# EAGLE board registers2a (EAGLE 7.5.0), part 1 of 2
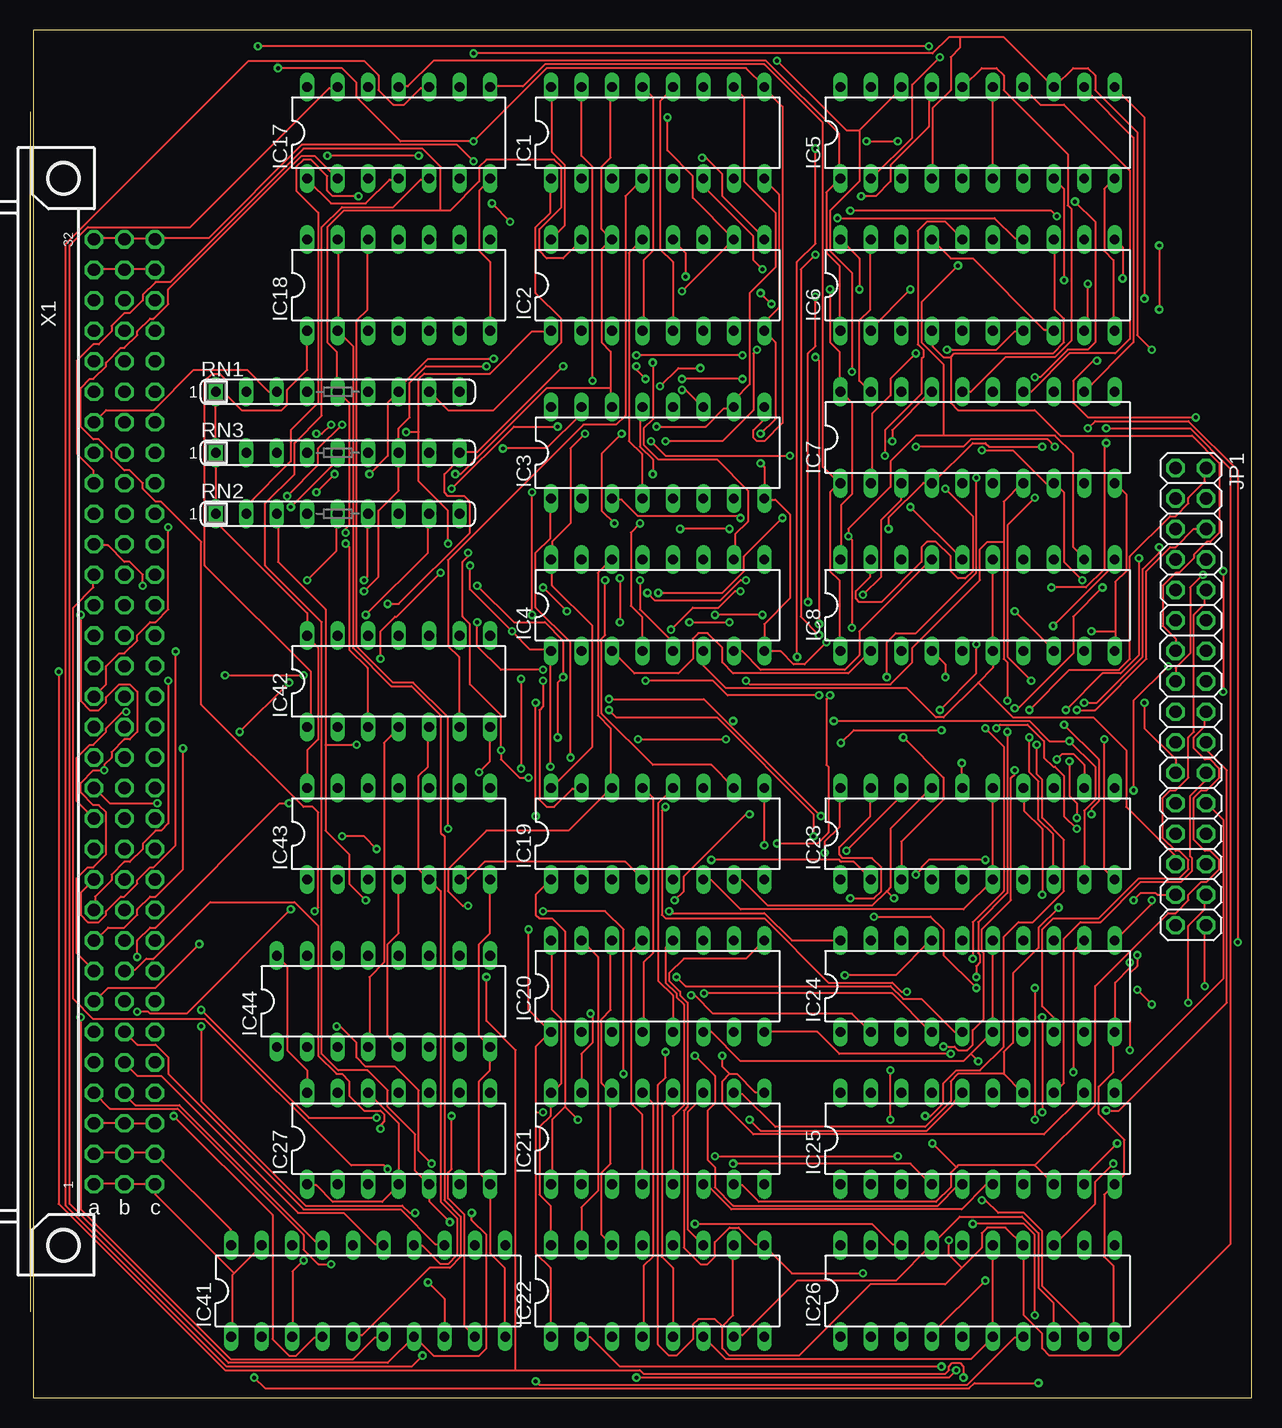
[diagram p3: board, top side]
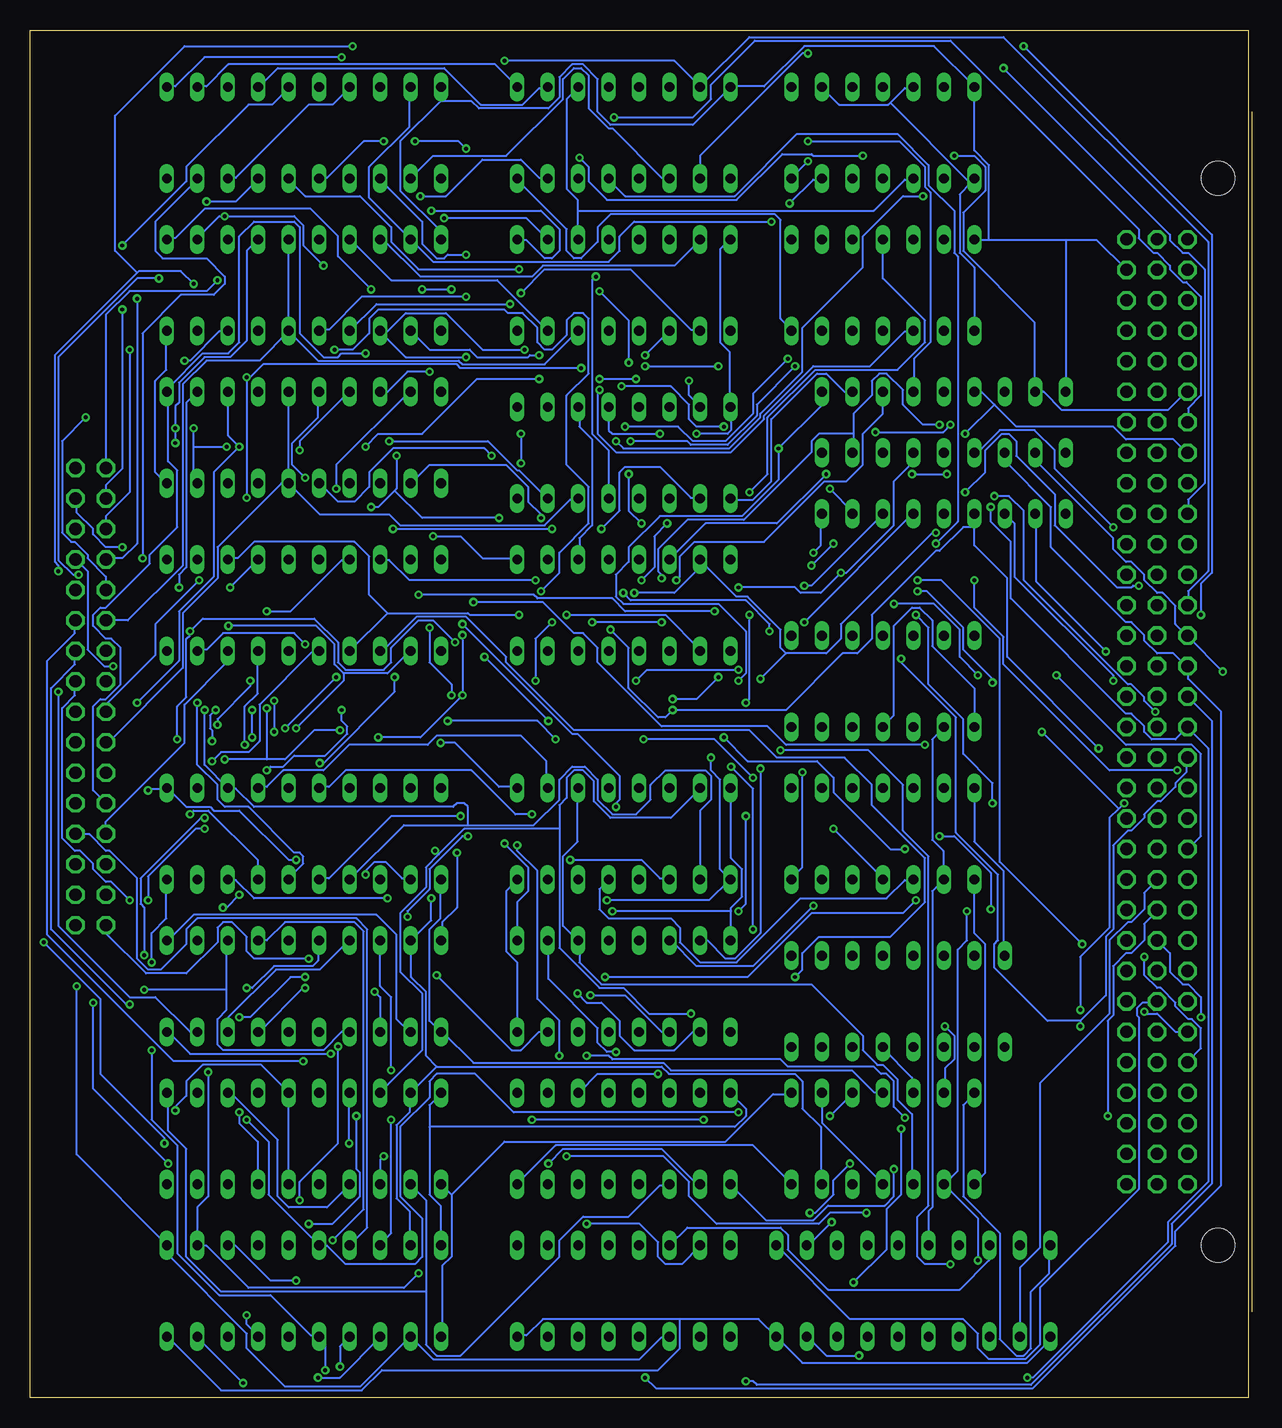
[diagram p4: board, bottom side, seen from below]

Size 101.58 x 113.97 mm. Coordinates in mm from the lower left corner, seen from the top.
Outline: 0,0 101.58,0 101.58,113.97 0,113.97 0,0
Copper layers (1*16): Top 0.0356mm / dielectric 1.5011mm / Bottom 0.0356mm
Design rules "LaenPCBOrder *": minimum track width 6mil, minimum drill 13mil, track to track 6mil, track to pad 6mil, pad to pad 6mil, via to via 6mil, smd to smd 6mil, copper to edge 15mil, drill to drill 6mil, minimum pad ring 7mil, minimum via ring 7mil, stop-mask expansion 3mil, vias tented up to drill 0mil, thermal gap 10mil

## Footprints (pad centres in the part's own frame; a part is rotated, then mirrored left to right if it is on the bottom)
DIL16 = drill 0.813 long: 1 -8.89,-3.81; 2 -6.35,-3.81; 3 -3.81,-3.81; 4 -1.27,-3.81; 5 1.27,-3.81; 6 3.81,-3.81; 7 6.35,-3.81; 8 8.89,-3.81; 9 8.89,3.81; 10 6.35,3.81; 11 3.81,3.81; 12 1.27,3.81; 13 -1.27,3.81; 14 -3.81,3.81; 15 -6.35,3.81; 16 -8.89,3.81
DIL20 = drill 0.813 long: 1 -11.43,-3.81; 2 -8.89,-3.81; 3 -6.35,-3.81; 4 -3.81,-3.81; 5 -1.27,-3.81; 6 1.27,-3.81; 7 3.81,-3.81; 8 6.35,-3.81; 9 8.89,-3.81; 10 11.43,-3.81; 11 11.43,3.81; 12 8.89,3.81; 13 6.35,3.81; 14 3.81,3.81; 15 1.27,3.81; 16 -1.27,3.81; 17 -3.81,3.81; 18 -6.35,3.81; 19 -8.89,3.81; 20 -11.43,3.81
DIL14 = drill 0.813 long: 1 -7.62,-3.81; 2 -5.08,-3.81; 3 -2.54,-3.81; 4 0,-3.81; 5 2.54,-3.81; 6 5.08,-3.81; 7 7.62,-3.81; 8 7.62,3.81; 9 5.08,3.81; 10 2.54,3.81; 11 0,3.81; 12 -2.54,3.81; 13 -5.08,3.81; 14 -7.62,3.81
2X16 = drill 1.016 octagon: 1 -19.05,-1.27; 2 -19.05,1.27; 3 -16.51,-1.27; 4 -16.51,1.27; 5 -13.97,-1.27; 6 -13.97,1.27; 7 -11.43,-1.27; 8 -11.43,1.27; 9 -8.89,-1.27; 10 -8.89,1.27; 11 -6.35,-1.27; 12 -6.35,1.27; 13 -3.81,-1.27; 14 -3.81,1.27; 15 -1.27,-1.27; 16 -1.27,1.27; 17 1.27,-1.27; 18 1.27,1.27; 19 3.81,-1.27; 20 3.81,1.27; 21 6.35,-1.27; 22 6.35,1.27; 23 8.89,-1.27; 24 8.89,1.27; 25 11.43,-1.27; 26 11.43,1.27; 27 13.97,-1.27; 28 13.97,1.27; 29 16.51,-1.27; 30 16.51,1.27; 31 19.05,-1.27; 32 19.05,1.27
SIL9 = drill 0.813 long: 1 -10.16,0; 2 -7.62,0; 3 -5.08,0; 4 -2.54,0; 5 0,0; 6 2.54,0; 7 5.08,0; 8 7.62,0; 9 10.16,0
FABC96R = drill 1.016 octagon: A1 -2.54,39.37; A2 -2.54,36.83; A3 -2.54,34.29; A4 -2.54,31.75; A5 -2.54,29.21; A6 -2.54,26.67; A7 -2.54,24.13; A8 -2.54,21.59; A9 -2.54,19.05; A10 -2.54,16.51; A11 -2.54,13.97; A12 -2.54,11.43; A13 -2.54,8.89; A14 -2.54,6.35; A15 -2.54,3.81; A16 -2.54,1.27; A17 -2.54,-1.27; A18 -2.54,-3.81; A19 -2.54,-6.35; A20 -2.54,-8.89; A21 -2.54,-11.43; A22 -2.54,-13.97; A23 -2.54,-16.51; A24 -2.54,-19.05; A25 -2.54,-21.59; A26 -2.54,-24.13; A27 -2.54,-26.67; A28 -2.54,-29.21; A29 -2.54,-31.75; A30 -2.54,-34.29; A31 -2.54,-36.83; A32 -2.54,-39.37; B1 -5.08,39.37; B2 -5.08,36.83; B3 -5.08,34.29; B4 -5.08,31.75; B5 -5.08,29.21; B6 -5.08,26.67; B7 -5.08,24.13; B8 -5.08,21.59; B9 -5.08,19.05; B10 -5.08,16.51; B11 -5.08,13.97; B12 -5.08,11.43; B13 -5.08,8.89; B14 -5.08,6.35; B15 -5.08,3.81; B16 -5.08,1.27; B17 -5.08,-1.27; B18 -5.08,-3.81; B19 -5.08,-6.35; B20 -5.08,-8.89; B21 -5.08,-11.43; B22 -5.08,-13.97; B23 -5.08,-16.51; B24 -5.08,-19.05; B25 -5.08,-21.59; B26 -5.08,-24.13; B27 -5.08,-26.67; B28 -5.08,-29.21; B29 -5.08,-31.75; B30 -5.08,-34.29; B31 -5.08,-36.83; B32 -5.08,-39.37; C1 -7.62,39.37; C2 -7.62,36.83; C3 -7.62,34.29; C4 -7.62,31.75; C5 -7.62,29.21; C6 -7.62,26.67; C7 -7.62,24.13; C8 -7.62,21.59; C9 -7.62,19.05; C10 -7.62,16.51; C11 -7.62,13.97; C12 -7.62,11.43; C13 -7.62,8.89; C14 -7.62,6.35; C15 -7.62,3.81; C16 -7.62,1.27; C17 -7.62,-1.27; C18 -7.62,-3.81; C19 -7.62,-6.35; C20 -7.62,-8.89; C21 -7.62,-11.43; C22 -7.62,-13.97; C23 -7.62,-16.51; C24 -7.62,-19.05; C25 -7.62,-21.59; C26 -7.62,-24.13; C27 -7.62,-26.67; C28 -7.62,-29.21; C29 -7.62,-31.75; C30 -7.62,-34.29; C31 -7.62,-36.83; C32 -7.62,-39.37 | hole 2.794: 0,-44.456; 0,44.456

## Placement (x,y rotation side)
IC1  74LS192N  [DIL16]  52.07,105.41 0 top
IC2  74LS192N  [DIL16]  52.07,92.71 0 top
IC3  74LS192N  [DIL16]  52.07,78.74 0 top
IC4  74LS192N  [DIL16]  52.07,66.04 0 top
IC5  74LS244N  [DIL20]  78.74,105.41 0 top
IC6  74LS244N  [DIL20]  78.74,92.71 0 top
IC7  74LS244N  [DIL20]  78.74,80.01 0 top
IC8  74LS244N  [DIL20]  78.74,66.04 0 top
IC17  7400N  [DIL14]  30.48,105.41 0 top
IC18  7400N  [DIL14]  30.48,92.71 0 top
IC19  74LS192N  [DIL16]  52.07,46.99 0 top
IC20  74LS192N  [DIL16]  52.07,34.29 0 top
IC21  74LS192N  [DIL16]  52.07,21.59 0 top
IC22  74LS192N  [DIL16]  52.07,8.89 0 top
IC23  74LS244N  [DIL20]  78.74,46.99 0 top
IC24  74LS244N  [DIL20]  78.74,34.29 0 top
IC25  74LS244N  [DIL20]  78.74,21.59 0 top
IC26  74LS244N  [DIL20]  78.74,8.89 0 top
IC27  7400N  [DIL14]  30.48,21.59 0 top
IC41  74S244N  [DIL20]  27.94,8.89 0 top
IC42  74LS08N  [DIL14]  30.48,59.69 0 top
IC43  74LS08N  [DIL14]  30.48,46.99 0 top
IC44  74LS139N  [DIL16]  29.21,33.02 0 top
JP1  [2X16]  96.52,58.42 270 top
RN1  [SIL9]  25.4,83.82 0 top
RN2  [SIL9]  25.4,73.66 0 top
RN3  [SIL9]  25.4,78.74 0 top
X1  FABC96R  [FABC96R]  2.54,57.15 180 top

## Tracks (layer width: path | path; a pad name or v marks a point on that pad's centre or on a via)
+12V
  Top 0.152: X1.A3 X1.B3 X1.C3
ADDR0  (via drill 0.33)
  Top 0.152: IC23.9 87.63,48.92 88.54,49.84 88.54,52.58 v86.41,54.71 84.73,54.71 83.06,56.39 v66.75,56.39 | v86.11,57.3 89.15,60.35 90.68,60.35 92.2,61.87 v92.2,69.95 | v36.27,70.41 36.27,70.1 35.81,69.65 35.81,65.08 36.42,64.47 36.42,59.44 39.01,56.84 v39.01,53.95 39.01,53.19 40.54,51.66 v41.3,51.66 | v24.84,11.12 23.77,11.12 22.55,12.34 22.55,13.56 12.04,24.08 6.4,24.08 X1.A4 | v50.44,54.86 v57.76,54.86
  Bottom 0.152: v86.41,54.71 86.41,55.63 86.56,55.78 86.56,56.84 v86.11,57.3 | v92.2,69.95 92.2,88.7 89,91.9 86.26,91.9 85.34,92.81 85.34,93.42 86.87,94.94 90.53,94.94 91.14,95.56 91.14,97.99 87.63,101.5 IC5.9 | v36.27,70.41 35.66,71.02 35.66,73.61 RN2.9 | v39.01,53.95 31.7,53.95 28.8,51.05 28.8,47.24 26.67,45.11 26.67,16 27.58,15.09 27.58,11.73 26.98,11.12 v24.84,11.12 | v66.75,56.39 59.28,56.39 v57.76,54.86 | v50.44,54.86 44.5,54.86 v41.3,51.66
ADDR1  (via drill 0.33)
  Top 0.152: v88.24,48.62 88.24,49.07 88.85,49.68 88.85,53.19 v85.95,56.08 | v83.21,59.74 81.23,61.72 81.23,72.69 v83.52,74.98 | v83.52,85.04 83.97,85.04 86.26,87.33 87.94,87.33 88.54,87.94 88.54,97.99 v86.87,99.67 | v27.74,65.23 32.92,70.41 32.92,73.61 RN2.8 | v21.34,49.53 20.57,49.53 10.21,39.17 9.75,39.17 8.69,38.1 v8.69,36.73 | v55.63,85.8 53.8,85.8 v52.27,84.28 | v43.74,80.92 40.08,80.92 v34.9,75.74
  Bottom 0.152: v88.24,48.62 87.94,48.92 86.72,48.92 82.6,44.81 82.6,43.28 IC23.7 | v85.95,56.08 85.95,56.54 83.21,59.28 v83.21,59.74 | v83.52,74.98 v83.52,85.04 83.21,85.04 82.14,86.11 65.99,86.11 65.68,85.8 v55.63,85.8 | v86.87,99.67 84.43,99.67 82.6,101.5 IC5.7 | v27.74,65.23 26.67,64.16 26.67,59.44 23.77,56.54 23.77,53.65 21.34,51.21 v21.34,49.53 | v8.69,36.73 8.69,35.2 7.62,34.14 7.32,34.14 6.1,32.92 6.1,32.61 5.03,31.55 4.72,31.55 3.96,30.79 3.96,29.11 5.03,28.04 X1.A5 | v52.27,84.28 48.16,84.28 46.63,82.75 46.63,81.53 46.02,80.92 v43.74,80.92 | v34.9,75.74 32.92,73.76 RN2.8
ADDR2  (via drill 0.33)
  Top 0.152: 58.06,56.08 55.93,58.22 v48.01,58.22 | 58.06,56.08 v65.68,48.46 | v37.03,67.67 40.08,64.62 42.67,64.62 44.2,63.09 v44.2,60.05 43.74,59.59 v43.74,55.02 | v69.49,104.7 v72.08,104.7 | v65.23,104.09 65.23,96.16 63.7,94.64 v63.7,61.72 | 58.06,56.08 v58.37,56.39 | v8.69,32.16 9.6,32.16 9.75,32 12.8,32 v21.49,40.69 | v25.76,46.79 27.58,46.79 v28.65,45.72
  Bottom 0.152: v65.68,48.46 71.48,48.46 76.66,43.28 77.42,43.28 IC23.5 | v48.01,58.22 46.02,58.22 v44.2,60.05 | v37.03,67.67 36.42,67.67 30.48,73.61 RN2.7 | v72.08,104.7 73.76,104.7 76.81,101.65 77.42,101.65 IC5.5 | v69.49,104.7 65.84,104.7 v65.23,104.09 | v58.37,56.39 v63.7,61.72 | X1.A6 6.1,30.48 7.62,32 8.53,32 v8.69,32.16 | v21.49,40.69 21.49,43.74 24.54,46.79 v25.76,46.79 | v28.65,45.72 29.87,45.72 34.59,50.44 34.59,51.66 35.97,53.03 41.76,53.03 v43.74,55.02
ADDR3  (via drill 0.33)
  Top 0.152: v27.58,68.12 27.89,68.43 27.89,73.61 RN2.6 | v13.87,37.8 10.21,34.14 6.25,34.14 5.18,33.07 X1.A7 | IC23.3 72.39,46.33 75.89,49.84 75.89,51.66 v72.54,55.02 | v65.53,63.55 64.01,65.08 64.01,94.03 v65.23,95.25 | v37.03,64.62 37.03,62.64 39.01,60.66 v42.52,60.66 | v51.05,59.74 56.69,59.74 57.91,58.52 v65.53,58.52
  Bottom 0.152: v27.58,68.12 25.6,68.12 20.73,63.25 20.73,44.65 v13.87,37.8 | v72.54,55.02 69.04,55.02 v65.53,58.52 v65.53,63.55 | v65.23,95.25 66.75,95.25 67.06,94.94 67.67,94.94 68.89,96.16 68.89,97.99 72.39,101.5 IC5.3 | v37.03,64.62 28.04,73.61 RN2.6 | v42.52,60.66 50.14,60.66 v51.05,59.74
ADDR4  (via drill 0.33)
  Top 0.152: v22.86,68.12 25.3,70.56 25.3,73.61 RN2.5 | X1.A8 5.03,35.66 3.66,37.03 3.66,43.28 4.57,44.2 5.03,44.2 6.1,45.26 6.1,48.77 5.49,49.38 5.03,49.38 3.96,50.44 3.96,51.21 5.03,52.27 v5.94,52.27 5.94,52.73 6.55,53.34 6.55,53.8 7.62,54.86 8.08,54.86 8.69,55.47 8.69,58.83 8.08,59.44 7.16,59.44 6.1,58.37 6.1,57.91 5.49,57.3 4.72,57.3 3.96,58.06 v3.96,65.23 | v99.21,68.89 v99.21,58.83 | v87.94,92.81 87.94,89.31 87.63,89 IC6.9 | v74.68,112.62 v18.75,112.62
  Bottom 0.152: v22.86,68.12 22.86,65.84 20.42,63.4 20.42,61.11 11.58,52.27 v5.94,52.27 | IC24.9 88.24,30.48 91.14,33.38 93.27,33.38 99.21,39.32 v99.21,58.83 | v99.21,68.89 99.21,69.34 99.52,69.65 99.52,86.87 92.66,93.73 | 92.66,93.73 92.51,93.88 89,93.88 v87.94,92.81 | v3.96,65.23 3.96,67.82 3.05,68.73 3.05,96.93 v18.75,112.62 | v74.68,112.62 88.7,112.62 94.49,106.83 94.49,95.56 92.66,93.73
ADDR5  (via drill 0.33)
  Top 0.152: v12.5,54.1 12.5,44.04 10.21,41.76 9.75,41.76 8.69,40.69 8.69,40.23 7.62,39.17 6.25,39.17 5.18,38.1 X1.A9 | v78.64,34.14 75.89,36.88 75.89,39.01 74.83,40.08 v70.1,40.08 | v65.08,46.79 65.08,48.62 57,56.69 48.62,56.69 v48.01,57.3 | v76.2,87.33 80.31,87.33 81.84,88.85 82.45,88.85 IC6.7 | v58.98,67.21 58.52,67.21 57.15,65.84 55.02,65.84 v53.19,64.01
  Bottom 0.152: 22.86,72.54 22.86,71.02 20.12,68.28 20.12,61.72 v12.5,54.1 | 22.86,72.54 RN2.4 22.86,73.61 | v78.64,34.14 78.79,34.14 82.45,30.48 IC24.7 | v70.1,40.08 70.1,40.54 68.28,42.37 68.28,44.04 65.53,46.79 v65.08,46.79 | 22.86,72.54 23.77,72.54 25.76,70.56 26.06,70.56 31.39,65.23 31.39,63.25 32.61,62.03 33.83,62.03 38.56,57.3 v48.01,57.3 48.62,56.69 49.23,56.69 51.66,59.13 51.66,62.48 v53.19,64.01 | v76.2,87.33 74.68,87.33 73.3,88.7 73.3,89.92 72.54,90.68 62.03,90.68 61.72,90.37 60.5,90.37 59.28,89.15 59.28,87.94 58.67,87.33 58.06,87.33 56.84,88.54 56.84,89.76 56.24,90.37 55.47,90.37 55.02,89.92 55.02,85.34 56.84,83.52 56.84,77.72 55.02,75.89 55.02,72.85 57.45,70.41 57.45,68.73 v58.98,67.21
ADDR6  (via drill 0.33)
  Top 0.152: IC24.5 76.81,30.48 74.07,33.22 72.54,33.22 71.48,34.29 54.41,34.29 v53.65,35.05 | v27.74,41.45 26.36,42.82 26.36,45.26 24.38,47.24 24.38,54.41 | 24.38,54.41 24.38,65.68 20.42,69.65 20.42,73.61 RN2.3 | v65.23,91.75 65.23,87.63 64.62,87.02 v64.62,66.29 | 24.38,54.41 v26.98,54.41 | v11.28,59.74 11.28,47.85 10.67,47.24 10.21,47.24 9.14,46.18 9.14,45.72 8.08,44.65 7.62,44.65 6.55,43.59 6.55,43.13 5.18,41.76 5.18,40.69 X1.A10
  Bottom 0.152: v53.65,35.05 41.76,35.05 36.42,40.39 28.8,40.39 v27.74,41.45 | v65.23,91.75 73.91,91.75 76.66,89 77.42,89 IC6.5 | v64.62,66.29 58.83,66.29 56.24,63.7 55.47,63.7 54.25,62.48 54.25,61.27 48.92,55.93 40.08,55.93 38.56,54.41 v26.98,54.41 | v11.28,59.74 11.28,60.2 19.51,68.43 19.51,72.85 RN2.3
ADDR7  (via drill 0.33)
  Top 0.152: v11.89,62.18 11.89,46.02 10.06,44.2 9.75,44.2 8.69,43.13 8.69,42.82 7.62,41.76 7.32,41.76 6.1,40.54 6.1,40.23 5.49,39.62 4.57,39.62 3.96,40.23 3.96,42.06 X1.A11 | v72.85,33.83 72.39,33.83 71.63,34.59 66.29,34.59 60.96,39.93 52.73,39.93 52.43,40.23 52.43,48.92 v52.73,49.23 | v65.53,64.47 65.53,86.41 v65.23,86.72 | v27.13,100.13 24.99,100.13 24.54,100.58 24.54,101.8 23.16,103.17 22.55,103.17 21.95,102.56 21.95,100.58 23.77,98.75 23.77,82.91 21.49,80.62 21.49,78.03 17.83,74.37 17.83,73.76 RN2.2 | v52.73,79.7 57.45,79.7 60.05,82.3 60.05,87.02 v60.35,87.33
  Bottom 0.152: v11.89,62.18 17.68,67.97 17.68,73.61 RN2.2 | IC24.3 72.39,33.38 v72.85,33.83 | v52.73,49.23 52.73,49.53 52.43,49.84 52.43,51.82 55.93,55.32 56.39,55.32 v65.53,64.47 | v65.23,86.72 70.26,86.72 72.08,88.54 | 72.08,88.54 72.39,88.85 IC6.3 72.08,88.54 | v27.13,100.13 28.8,100.13 32.16,96.77 32.16,94.18 37.19,89.15 37.19,85.5 40.69,81.99 40.69,81.69 43.28,79.1 52.12,79.1 v52.73,79.7 | v60.35,87.33 63.86,87.33 66.9,90.37 70.26,90.37 72.08,88.54
ADDR8  (via drill 0.33)
  Top 0.152: v29.57,66.14 30.48,66.14 36.42,72.08 36.42,74.68 35.97,75.13 34.59,75.13 34.29,75.44 34.29,76.96 35.51,78.18 35.51,78.64 RN3.9 35.66,78.79 37.03,78.79 v44.2,85.95 | v16,60.2 v22.55,60.2 | IC25.9 87.63,18.44 v90.37,21.18 | v100.43,37.95 100.43,77.27 96.32,81.38 88.54,81.38 v87.94,80.77 | v50.29,85.95 50.29,85.65 v51.05,84.89 | v59.13,84.89 v54.1,84.89 | v73.61,79.25 77.57,79.25 78.18,79.86 84.58,79.86 v85.19,79.25
  Bottom 0.152: v29.57,66.14 26.21,66.14 24.08,64.01 24.08,61.72 v22.55,60.2 | v16,60.2 10.21,54.41 4.72,54.41 3.96,53.65 3.96,46.79 5.03,45.72 X1.A12 | v90.37,21.18 90.37,21.64 95.71,26.98 95.71,33.22 v100.43,37.95 | 87.94,79.25 87.94,76.5 IC7.9 | 87.94,79.25 v87.94,80.77 | v50.29,85.95 v44.2,85.95 | v54.1,84.89 v51.05,84.89 | v59.13,84.89 64.31,84.89 68.89,80.31 72.54,80.31 v73.61,79.25 | 87.94,79.25 v85.19,79.25
ADDR9  (via drill 0.33)
  Top 0.152: v84.12,31.7 v84.12,23.77 | v78.64,35.05 78.64,35.97 78.94,36.27 78.94,36.88 78.79,37.03 78.79,39.62 81.23,42.06 v81.23,55.47 | v81.23,58.06 81.23,61.27 80.92,61.57 80.92,71.32 | 80.92,71.32 80.92,74.68 82.45,76.2 IC7.7 | v25.76,81.08 23.77,79.1 23.77,77.72 v21.18,75.13 | v7.77,57.15 7.47,57.15 6.1,55.78 6.1,55.47 5.03,54.41 4.72,54.41 3.66,53.34 3.66,49.68 X1.A13 | 80.92,71.32 79.55,71.32 78.94,70.71 78.94,68.12 73.3,62.48 73.3,61.27 71.48,59.44 59.74,59.44 v59.44,59.74 | v54.71,64.62 v58.06,64.62 | v48.92,68.28 v48.92,64.62
  Bottom 0.152: v84.12,23.77 84.12,22.86 82.6,21.34 82.6,17.83 IC25.7 | v84.12,31.7 83.21,31.7 79.86,35.05 v78.64,35.05 | v81.23,58.06 v81.23,55.47 | 32.92,80.31 32.92,81.99 31.39,83.52 31.39,84.73 30.79,85.34 30.18,85.34 28.8,83.97 28.8,82.75 27.13,81.08 v25.76,81.08 | 32.92,80.31 32.92,78.79 RN3.8 | v21.18,75.13 19.96,75.13 18.75,73.91 18.75,68.12 10.06,59.44 9.75,59.44 8.69,58.37 8.69,58.06 v7.77,57.15 | v59.44,59.74 59.44,63.25 v58.06,64.62 | v48.92,64.62 v54.71,64.62 | v48.92,68.28 48.92,68.58 49.23,68.89 49.23,70.71 46.79,73.15 42.06,73.15 36.42,78.79 36.42,79.7 35.81,80.31 32.92,80.31
ADDR10  (via drill 0.33)
  Top 0.152: v55.17,28.5 56.84,26.82 56.84,24.54 56.24,23.93 56.24,19.81 56.84,19.2 56.84,17.53 58.37,16 75.44,16 77.11,17.68 77.42,17.68 IC25.5 | v28.65,23.32 23.01,23.32 v14.02,32.31 | v10.36,49.53 6.4,49.53 5.18,50.75 X1.A14 | v27.58,67.21 28.8,68.43 28.8,73.91 30.48,75.59 RN3.7 30.48,80.77 31.39,81.69 31.39,84.58 32.77,85.95 v37.8,85.95 | v17.22,55.47 v21.34,59.59 | v63.09,78.49 52.73,78.49 v51.51,79.7
  Bottom 0.152: v55.17,28.5 53.34,28.5 53.03,28.19 39.01,28.19 38.41,27.58 31.24,27.58 30.63,26.98 30.18,26.98 29.57,26.36 29.57,24.23 v28.65,23.32 | v14.02,32.31 14.02,36.73 11.58,39.17 11.58,48.31 10.82,49.07 | v10.36,49.53 10.82,49.07 | v27.58,67.21 26.82,67.21 23.77,64.16 23.77,62.33 21.34,59.89 v21.34,59.59 | 10.82,49.07 v17.22,55.47 | v63.09,78.49 63.7,79.1 71.32,79.1 73.3,77.11 73.3,75.89 74.52,74.68 75.89,74.68 77.42,76.2 IC7.5 | v51.51,79.7 46.79,79.7 46.48,79.4 43.43,79.4 41,81.84 41,82.75 v37.8,85.95
ADDR11  (via drill 0.33)
  Top 0.152: v56.84,20.12 v72.08,20.12 | v31.85,15.39 31.39,15.39 30.79,16 22.71,16 14.02,24.69 v14.02,30.94 | v33.98,68.73 30.33,65.08 30.18,65.08 28.96,63.86 v28.96,61.57 | IC7.3 72.39,74.83 70.71,73.15 70.71,68.43 v69.19,66.9 | v42.52,67.51 v44.5,65.53
  Bottom 0.152: IC25.3 72.39,19.81 v72.08,20.12 | v56.84,20.12 48.77,20.12 46.63,17.98 46.63,16.76 44.35,14.48 35.81,14.48 34.9,15.39 v31.85,15.39 | 14.02,31.39 v14.02,30.94 | 14.02,31.39 11.89,33.53 11.89,38.41 11.28,39.01 11.28,46.02 10.06,47.24 9.75,47.24 8.69,48.31 8.69,48.62 7.62,49.68 7.32,49.68 6.1,50.9 6.1,51.21 5.18,52.12 5.18,53.34 X1.A15 | v28.96,61.57 28.96,61.27 24.38,56.69 24.38,47.09 20.88,43.59 20.88,38.1 21.18,37.8 21.18,35.81 16.76,31.39 14.02,31.39 | RN3.6 28.04,78.64 28.04,77.88 29.57,76.35 29.57,72.69 33.53,68.73 v33.98,68.73 35.66,67.06 37.34,67.06 37.8,67.51 v42.52,67.51 | v69.19,66.9 59.59,66.9 59.28,66.6 53.03,66.6 51.97,65.53 v44.5,65.53
ADDR12  (via drill 0.33)
  Top 0.152: v21.49,74.22 25.3,78.03 25.3,78.64 RN3.5 | v83.82,1.22 78.49,1.22 78.03,0.76 19.36,0.76 v18.44,1.68 | v78.64,62.79 78.64,60.35 v75.59,57.3 | v81.84,52.27 81.84,51.97 81.53,51.66 81.53,41.45 79.1,39.01 79.1,37.19 79.25,37.03 79.25,31.55 78.33,30.63 78.33,29.41 77.88,28.96 77.11,28.96 76.81,29.26 v75.89,29.26 | v79.1,16.46 79.4,16.46 80.47,15.39 82.6,15.39 84.12,13.87 84.12,9.3 87.63,5.79 IC26.9
  Bottom 0.152: v21.49,74.22 21.49,73 19.81,71.32 19.81,66.6 10.21,57 9.75,57 8.69,55.93 8.69,55.47 8.08,54.86 6.1,54.86 X1.A16 5.03,55.78 3.35,54.1 3.35,17.98 6.71,14.63 6.71,12.95 17.98,1.68 v18.44,1.68 | v83.82,1.22 87.63,5.03 IC26.9 | v78.64,62.79 79.55,63.7 85.5,63.7 86.87,62.33 87.63,62.33 IC8.9 | v75.59,57.3 75.59,56.39 75.13,55.93 75.13,55.32 76.96,53.49 79.55,53.49 80.47,52.58 81.53,52.58 v81.84,52.27 | v75.89,29.26 75.89,21.18 79.1,17.98 v79.1,16.46
ADDR13  (via drill 0.33)
  Top 0.152: v41.91,1.37 42.22,1.07 77.88,1.07 81.84,5.03 82.45,5.03 IC26.7 | v11.28,72.54 11.28,65.68 10.21,64.62 9.75,64.62 8.69,63.55 8.69,63.09 7.62,62.03 7.16,62.03 6.1,60.96 6.1,59.44 X1.A17 | v83.67,54.41 83.67,51.97 84.12,51.51 84.12,48.31 85.95,46.48 85.95,42.22 83.36,39.62 82.14,39.62 80.92,38.41 80.92,29.26 78.94,27.28 76.96,27.28 75.89,26.21 75.89,24.54 74.83,23.47 v74.37,23.47 | v78.33,14.48 82.6,14.48 83.52,13.56 v83.52,6.86
  Bottom 0.152: v41.91,1.37 41.3,1.37 41,1.07 18.14,1.07 6.4,12.8 6.4,14.48 3.05,17.83 3.05,56.39 X1.A17 | v11.28,72.54 16.15,77.42 16.15,78.94 17.83,80.62 20.73,80.62 22.55,78.79 22.86,78.79 RN3.4 | v83.67,54.41 83.67,57.61 82.6,58.67 82.6,62.18 IC8.7 | v74.37,23.47 74.37,19.05 74.07,18.75 74.07,16.76 76.35,14.48 v78.33,14.48 | v83.52,6.86 83.52,6.1 82.6,5.18 IC26.7
ADDR14  (via drill 0.33)
  Top 0.152: v91.44,28.96 91.44,35.36 92.05,35.97 v92.05,36.88 | v87.02,48.31 87.02,49.53 86.41,50.14 v86.41,53.03 | v50.29,1.68 76.35,1.68 v76.96,2.29
  Bottom 0.152: RN3.3 20.27,78.64 20.27,78.03 16.46,74.22 16.46,70.87 10.21,64.62 9.75,64.62 8.69,63.55 8.69,63.09 7.62,62.03 6.25,62.03 5.18,60.96 X1.A18 5.03,60.96 5.03,59.89 2.29,57.15 2.29,17.68 6.1,13.87 6.1,12.65 17.98,0.76 49.38,0.76 v50.29,1.68 | v91.44,28.96 91.44,23.16 89.31,21.03 89.31,12.04 85.8,8.53 81.53,8.53 78.18,5.18 77.57,5.18 IC26.5 76.96,4.57 v76.96,2.29 | v92.05,36.88 92.05,40.84 92.35,41.15 92.35,43.28 87.33,48.31 v87.02,48.31 | v86.41,53.03 85.65,53.8 83.36,53.8 82.45,54.71 82.45,57.76 78.03,62.18 77.57,62.18 IC8.5
ADDR15  (via drill 0.33)
  Top 0.152: v77.57,1.68 77.57,2.59 77.27,2.9 76.66,2.9 76.35,2.59 76.35,2.29 76.05,1.98 50.9,1.98 50.6,2.29 40.23,2.29 | 40.23,2.29 16,2.29 2.13,16.15 v2.13,60.5 | v37.8,35.05 37.8,31.39 40.23,28.96 40.23,2.29
  Bottom 0.152: v77.57,1.68 75.74,1.68 72.39,5.03 IC26.3 | v2.13,60.5 5.03,63.4 X1.A19 5.18,63.55 6.1,64.47 6.1,65.99 7.16,67.06 7.62,67.06 8.69,68.12 8.69,68.58 9.75,69.65 10.21,69.65 11.28,70.71 11.28,71.63 17.68,78.03 17.68,78.64 RN3.2 | v37.8,35.05 37.19,35.66 37.19,37.03 35.81,38.41 29.87,38.41 26.98,41.3 26.98,44.96 31.39,49.38 31.39,51.05 33.68,53.34 39.32,53.34 41.6,55.63 56.24,55.63 61.87,61.27 61.87,61.72 65.23,65.08 69.34,65.08 72.08,62.33 72.39,62.33 IC8.3
DATA0  (via drill 0.33)
  Top 0.152: IC21.15 45.72,28.65 46.63,29.57 46.63,31.85 v46.48,32 | IC23.18 72.39,50.14 v67.82,45.57 | v68.28,85.5 68.28,93.73 66.45,95.56 66.45,98.91 68.89,101.35 68.89,105.61 | 68.89,105.61 72.39,109.12 IC5.18 | v39.17,79.1 42.82,79.1 45.72,81.99 IC3.15 | IC1.15 45.72,103.48 46.63,102.56 v46.63,84.73 | 68.89,105.61 67.82,105.61 v62.03,111.4 | v42.52,59.74 42.52,57.61 42.22,57.3 42.22,49.84 42.82,49.23 43.43,49.23 44.96,50.75 45.72,50.75 IC19.15
  Bottom 0.152: v46.48,32 49.99,32 52.12,34.14 54.1,34.14 57.45,37.49 57.45,47.4 | 57.45,47.4 57.45,49.38 56.84,49.99 56.84,51.66 56.24,52.27 55.47,52.27 54.56,51.36 54.56,49.68 53.19,48.31 48.16,48.31 45.72,50.75 IC19.15 | 67.51,45.26 65.38,47.4 57.45,47.4 | 67.51,45.26 68.58,44.2 68.58,42.52 70.71,40.39 70.71,35.51 68.89,33.68 68.89,28.96 72.39,25.45 IC25.18 | 67.51,45.26 v67.82,45.57 | IC7.18 71.78,83.82 70.1,85.5 v68.28,85.5 | RN1.9 35.66,83.82 35.66,82.6 v39.17,79.1 39.17,76.5 42.22,73.46 49.07,73.46 51.66,70.87 51.66,69.65 52.73,68.58 52.73,66.75 52.12,66.14 44.2,66.14 41.91,63.86 41.91,60.35 v42.52,59.74 | v46.63,84.73 46.63,83.52 45.72,82.6 IC3.15 | 45.72,109.27 41.6,113.39 20.42,113.39 3.35,96.32 3.35,68.89 5.03,67.21 5.03,66.14 X1.A20 | v62.03,111.4 47.85,111.4 45.72,109.27 | 45.72,109.27 IC1.15
DATA1  (via drill 0.33)
  Top 0.152: IC1.1 43.13,101.5 43.13,98.75 41.91,97.54 41.91,92.05 44.04,89.92 44.04,87.94 38.41,82.3 34.59,82.3 33.07,83.82 RN1.8 | IC7.16 78.18,83.82 81.08,86.72 85.19,86.72 86.56,88.09 86.56,99.06 86.26,99.36 86.26,103.63 80.92,108.97 80.92,110.19 80.31,110.8 79.1,110.8 77.57,109.27 IC5.16 | 44.35,24.23 43.28,23.16 43.28,17.83 IC21.1 | 44.35,24.23 44.35,38.86 43.28,39.93 42.22,39.93 41.91,40.23 41.91,41.91 IC19.1 | v59.74,23.16 60.66,22.25 74.52,22.25 76.81,24.54 76.81,24.69 77.42,25.3 IC25.16 | 44.35,24.23 v45.41,23.16 | v59.74,48.62 59.44,48.62 54.25,43.43 54.25,42.22 v53.49,41.45 | v29.57,19.05 29.26,19.36 26.52,19.36 14.33,31.55 5.03,31.55 3.35,33.22 3.35,65.84 5.03,67.51 5.03,68.58 X1.A21 | v78.64,76.66 78.64,68.73 73.61,63.7 71.93,63.7 71.17,62.94 v71.17,60.05 | v77.42,52.88 77.42,50.9 IC23.16 | v44.81,53.34 44.81,62.94 41.91,65.84 41.91,70.41 43.13,71.63 43.13,74.83 IC3.1
  Bottom 0.152: RN1.8 33.68,83.82 35.2,85.34 35.97,85.34 39.78,81.53 39.78,76.35 41.3,74.83 43.13,74.83 IC3.1 | v45.41,23.16 v59.74,23.16 | v59.74,48.62 61.11,48.62 64.77,52.27 75.29,52.27 76.66,50.9 77.42,50.9 IC23.16 | v53.49,41.45 44.96,41.45 43.28,43.13 IC19.1 44.04,44.04 44.04,51.51 44.81,52.27 v44.81,53.34 | v29.57,19.05 29.57,16.76 30.33,16 35.05,16 36.27,14.78 40.23,14.78 43.13,17.68 IC21.1 | v78.64,76.66 79.7,77.72 79.7,79.55 77.57,81.69 77.57,83.82 IC7.16 | v71.17,60.05 71.17,58.83 77.11,52.88 v77.42,52.88
DATA2  (via drill 0.33)
  Top 0.152: IC1.10 59.28,108.36 59.28,101.35 61.87,98.75 61.87,94.18 59.74,92.05 59.74,84.43 58.52,83.21 58.52,82.6 IC3.10 58.37,82.45 57.61,82.45 56.08,80.92 v51.97,80.92 | IC7.14 83.21,83.82 86.41,87.02 90.22,87.02 91.44,88.24 91.44,102.26 85.95,107.75 83.97,107.75 82.6,109.12 IC5.14 | 80.92,26.98 77.11,26.98 76.5,26.36 76.5,24.69 74.37,22.55 61.87,22.55 59.13,25.3 58.52,25.3 IC21.10 | 80.92,26.98 82.45,25.45 IC25.14 | v47.7,68.12 47.7,63.55 47.4,63.25 47.4,57 51.66,52.73 56.54,52.73 58.37,50.9 IC19.10 | v9.14,67.67 9.14,68.58 8.08,69.65 7.62,69.65 6.25,71.02 5.18,71.02 X1.A22 | v25.15,76.96 v23.62,75.44 | v28.04,76.96 29.57,78.49 29.57,82.91 RN1.7 30.48,84.12 32.92,86.56 v38.41,86.56 | 80.92,26.98 80.92,28.8 81.69,29.57 81.69,35.36 83.82,37.49 83.82,39.17 v85.5,40.84 | v84.12,41.91 84.12,47.4 82.6,48.92 82.6,50.75 IC23.14
  Bottom 0.152: IC1.10 58.52,109.12 59.13,109.12 60.5,107.75 64.01,107.75 67.06,110.8 80.92,110.8 82.45,109.27 IC5.14 | RN1.7 30.48,81.99 32.16,80.31 32.16,77.72 33.53,76.35 35.36,76.35 40.39,71.32 46.18,71.32 47.4,70.1 47.4,68.43 v47.7,68.12 | IC23.14 82.45,50.9 81.84,50.9 80.47,52.27 77.11,52.27 74.98,54.41 68.43,54.41 67.67,55.17 60.66,55.17 58.52,53.03 58.52,50.9 IC19.10 | v9.14,67.67 9.6,67.67 9.75,67.51 10.97,67.51 16.15,72.69 16.15,75.29 19.36,78.49 19.36,79.7 19.96,80.31 20.57,80.31 21.95,78.94 21.95,77.11 v23.62,75.44 | v28.04,76.96 v25.15,76.96 | v85.5,40.84 85.19,40.84 v84.12,41.91 | v51.97,80.92 47.55,80.92 46.33,79.7 43.59,79.7 41.3,81.99 41.3,83.67 v38.41,86.56
DATA3  (via drill 0.33)
  Top 0.152: 58.06,26.98 58.67,26.98 60.2,25.45 60.96,25.45 IC21.9 | 58.06,26.98 57.45,26.36 57.45,24.54 60.05,21.95 84.28,21.95 87.63,25.3 IC25.12 | v60.96,46.02 IC19.9 | v57.45,28.5 57.45,27.58 58.06,26.98 | IC23.12 87.63,52.73 86.72,53.65 85.8,53.65 v85.34,53.19 | v75.74,55.63 68.43,55.63 v67.36,54.56 | IC7.12 91.75,87.94 91.75,105 87.63,109.12 IC5.12 | IC3.9 60.96,81.53 60.05,80.62 60.05,80.01 60.35,79.7 60.96,79.7 62.48,81.23 62.48,107.59 60.96,109.12 IC1.9 60.96,109.27 59.44,110.8 42.82,110.8 v36.73,104.7 30.63,104.7 26.98,108.36 26.98,109.58 25.76,110.8 v20.42,110.8 | v81.84,57.45 82.14,57.45 86.72,62.03 86.72,65.08 v89.15,67.51
  Bottom 0.152: v60.96,46.02 60.96,45.57 59.28,43.89 59.28,33.22 57.45,31.39 v57.45,28.5 | 81.84,53.19 80.31,53.19 77.88,55.63 v75.74,55.63 | 81.84,53.19 v85.34,53.19 | v67.36,54.56 66.14,54.56 62.48,50.9 60.96,50.9 IC19.9 | v36.73,104.7 29.11,104.7 26.98,102.56 26.98,100.89 26.52,100.43 26.52,87.94 27.89,86.56 27.89,83.82 RN1.6 | v20.42,110.8 6.55,96.93 6.55,96.47 5.49,95.4 5.03,95.4 3.66,94.03 3.66,76.2 5.03,74.83 5.03,73.76 X1.A23 | IC5.12 87.63,109.27 86.87,109.27 85.04,111.1 62.79,111.1 60.96,109.27 IC1.9 | v81.84,57.45 81.84,53.19 | v89.15,67.51 89.15,68.58 88.54,69.19 88.54,82.91 IC7.12
DATA4  (via drill 0.33)
  Top 0.152: IC22.15 45.72,15.85 47.09,17.22 47.09,36.73 IC20.15 | v55.17,14.48 69.95,14.48 71.63,12.8 72.39,12.8 IC26.18 | v71.48,23.16 v71.48,27.28 | 33.98,98.91 34.75,98.91 37.19,101.35 37.19,102.56 37.8,103.17 43.43,103.17 44.04,102.56 44.04,99.21 42.22,97.38 42.22,95.56 42.82,94.94 44.2,94.94 45.72,96.47 IC2.15 | 33.98,98.91 25.91,98.91 24.54,97.54 24.54,87.94 25.3,87.17 25.3,83.82 RN1.5 25.45,83.82 26.36,82.91 26.36,72.69 26.06,72.39 v26.06,72.08 | v59.44,68.12 58.98,68.12 57.3,66.45 51.82,66.45 v51.21,67.06 | 33.98,98.91 33.98,102.56 32.46,104.09 22.55,104.09 11.43,92.96 10.21,92.96 9.14,91.9 9.14,91.44 8.08,90.37 7.62,90.37 6.55,89.31 6.55,88.85 5.49,87.78 5.03,87.78 3.66,86.41 3.66,78.64 5.03,77.27 5.03,76.2 X1.A24 | v40.69,59.89 v40.69,52.43
  Bottom 0.152: v55.17,14.48 50.75,14.48 49.23,12.95 49.23,11.73 48.62,11.12 47.24,11.12 45.72,12.65 IC22.15 | IC24.18 72.39,34.29 71.48,33.38 v71.48,27.28 | v71.48,23.16 71.48,13.72 72.39,12.8 IC26.18 | 45.41,69.49 42.67,66.75 41.76,66.75 39.01,64.01 39.01,62.48 38.56,62.03 | 45.41,69.49 45.72,69.8 IC4.15 45.41,69.49 | 38.56,62.03 35.2,62.03 33.98,63.25 33.98,64.47 26.36,72.08 v26.06,72.08 | v59.44,68.12 69.95,68.12 71.63,69.8 72.39,69.8 IC8.18 | v51.21,67.06 47.85,67.06 45.41,69.49 | IC6.18 72.39,96.47 72.08,96.47 69.04,93.42 59.74,93.42 58.83,94.34 47.85,94.34 45.72,96.47 IC2.15 | IC20.15 45.11,38.1 43.59,36.58 42.82,36.58 40.69,38.71 v40.69,52.43 | 38.56,62.03 v40.69,59.89
DATA5  (via drill 0.33)
  Top 0.152: v73.15,74.22 77.42,69.95 IC8.16 | v71.02,78.49 71.02,80.62 74.07,83.67 74.07,86.56 74.22,86.72 74.22,87.33 73.76,87.78 73.76,97.23 74.52,97.99 76.05,97.99 77.42,96.62 IC6.16 | v83.52,34.14 v83.52,23.16 | 41.91,23.77 41.91,29.26 43.13,30.48 | 41.91,23.77 41.91,12.04 43.13,10.82 43.13,5.18 IC22.1 | v43.13,52.58 43.13,62.18 IC4.1 43.13,62.33 41.45,62.33 v39.93,63.86 36.42,67.36 v36.42,69.34 | v41.3,39.01 41.3,32.31 43.13,30.48 | 43.13,30.48 IC20.1 | 32.16,80.47 32.16,76.35 34.59,73.91 v34.59,71.17 | 32.16,80.47 32.16,84.89 32.61,85.34 38.1,85.34 41.6,88.85 43.13,88.85 IC2.1 | v23.62,80.31 24.08,80.31 v24.84,81.08 | 32.16,80.47 v31.09,80.47 | 41.91,23.77 v42.52,23.77 | v62.48,73.3 59.28,70.1 59.28,68.89 57.45,67.06 v52.12,67.06
  Bottom 0.152: v73.15,74.22 72.54,74.22 71.17,75.59 | 71.17,75.59 71.02,75.74 v71.02,78.49 | v83.52,23.16 81.69,21.34 81.69,16.92 IC26.16 77.42,12.65 76.81,12.65 75.29,11.12 69.49,11.12 68.89,11.73 68.89,14.94 70.71,16.76 70.71,22.55 68.28,24.99 68.28,26.36 67.67,26.98 64.47,26.98 61.27,23.77 v42.52,23.77 | v83.52,34.14 83.06,34.14 81.23,35.97 78.03,35.97 77.57,36.42 77.57,38.1 IC24.16 | RN1.4 22.25,83.82 21.18,82.75 | 21.18,82.75 19.36,80.92 11.28,80.92 10.21,79.86 6.25,79.86 5.18,78.79 X1.A25 | v43.13,52.58 41.3,50.75 v41.3,39.01 | v36.42,69.34 v34.59,71.17 | v23.62,80.31 21.18,82.75 | v24.84,81.08 25.45,80.47 v31.09,80.47 | 71.17,75.59 68.89,73.3 v62.48,73.3 | v52.12,67.06 51.51,66.45 41.91,66.45 39.93,64.47 v39.93,63.86
DATA6  (via drill 0.33)
  Top 0.152: 57.45,5.94 58.37,6.86 58.37,12.65 IC22.10 | 57.45,5.94 57.45,4.12 58.06,3.5 63.86,3.5 69.8,9.45 76.05,9.45 77.42,10.82 | 77.42,10.82 79.1,12.5 79.1,13.72 79.55,14.17 81.08,14.17 IC26.14 82.6,12.65 82.6,6.86 84.12,5.33 84.12,4.12 84.73,3.5 90.53,3.5 99.82,12.8 99.82,77.42 96.47,80.77 v89.46,80.77 | v52.73,28.8 52.73,26.67 52.12,26.06 52.12,4.42 53.03,3.5 53.65,3.5 55.02,4.88 55.02,6.1 55.47,6.55 56.84,6.55 57.45,5.94 | v76.35,13.11 76.35,11.89 77.42,10.82 | v84.89,67.51 87.78,67.51 89.31,69.04 89.31,79.4 v89.46,79.55 | RN1.3 19.66,83.82 17.83,85.65 13.41,85.65 10.06,82.3 6.1,82.3 X1.A26 | v51.66,86.26 51.66,81.53 50.9,80.77 50.9,79.4 52.12,78.18 57,78.18 59.59,75.59 59.59,73 58.52,71.93 58.52,69.95 IC4.10 | v54.1,92.2 IC2.10 58.37,96.62 55.02,99.97 55.02,101.8 52.88,103.94 v52.88,106.68 | v67.06,98.3 80.16,98.3 81.84,96.62 82.45,96.62 IC6.14
  Bottom 0.152: v52.73,28.8 53.49,28.8 54.25,29.57 54.25,30.79 58.37,34.9 58.37,38.1 IC20.10 | IC24.14 81.84,38.1 80.31,39.62 74.52,39.62 73.76,38.86 73.76,15.7 v76.35,13.11 | v84.89,67.51 IC8.14 | v89.46,79.55 v89.46,80.77 89.46,82.6 89.15,82.91 89.15,84.58 87.02,86.72 84.89,86.72 83.52,88.09 83.52,95.56 IC6.14 | v51.66,86.26 51.66,89.76 v54.1,92.2 | v52.88,106.68 46.33,106.68 44.81,108.2 44.81,109.42 41.15,113.08 24.84,113.08 9.14,97.38 9.14,96.62 7.92,95.4 7.62,95.4 6.55,94.34 6.55,94.03 5.49,92.96 5.18,92.96 3.96,91.75 3.96,83.52 5.03,82.45 5.03,81.38 X1.A26 | v67.06,98.3 60.2,98.3 IC2.10
DATA7  (via drill 0.33)
  Top 0.152: v86.72,27.13 86.72,37.19 IC24.12 | IC20.9 59.44,36.58 54.25,36.58 53.03,35.36 53.03,34.75 53.95,33.83 53.95,33.53 54.56,32.92 54.56,24.23 54.25,23.93 54.25,12.5 55.63,11.12 56.24,11.12 56.84,11.73 56.84,12.95 58.06,14.17 58.83,14.17 60.2,12.8 60.96,12.8 IC22.9 60.96,12.65 63.25,10.36 v69.19,10.36 | 75.89,80.16 85.19,80.16 86.72,78.64 86.72,70.87 87.63,69.95 IC8.12 | 75.89,80.16 73.61,80.16 71.48,78.03 71.48,75.89 67.97,72.39 v67.97,71.78 68.28,71.48 v68.28,64.16 | v68.12,98.91 84.89,98.91 v85.34,98.45 | v32.16,103.48 v24.54,103.48 | v55.78,103.33 56.08,103.33 57.45,101.96 57.45,100.13 60.96,96.62 IC2.9 | 75.89,80.16 75.89,86.11 74.07,87.94 74.07,91.29 v77.11,94.34 | v62.03,46.18 65.38,46.18 66.29,47.09 66.29,52.58 66.14,52.73 66.14,58.22 v66.45,58.52
  Bottom 0.152: v86.72,27.13 86.72,16.76 87.63,15.85 IC26.12 87.63,12.65 86.87,12.65 83.36,9.14 70.41,9.14 v69.19,10.36 | v67.97,71.78 65.68,71.78 63.86,69.95 60.96,69.95 IC4.9 | X1.A27 5.18,83.82 6.71,82.3 15.54,82.3 17.07,83.82 RN1.2 17.83,83.82 17.83,89.61 23.77,95.56 23.77,98.75 21.95,100.58 21.95,102.56 22.86,103.48 v24.54,103.48 | v68.12,98.91 58.98,98.91 57.45,97.38 57.45,95.56 58.06,94.94 58.67,94.94 60.2,96.47 60.96,96.47 IC2.9 | IC6.12 87.63,96.62 85.8,98.45 v85.34,98.45 79.55,98.45 78.79,97.69 78.79,96.01 v77.11,94.34 | v32.16,103.48 36.27,103.48 36.42,103.63 38.86,103.63 42.67,99.82 53.49,99.82 55.02,101.35 55.02,102.56 v55.78,103.33 | IC20.9 60.96,41.3 60.05,42.22 60.05,44.2 v62.03,46.18 | v66.45,58.52 66.45,59.44 68.28,61.27 v68.28,64.16
GND  (via drill 0.33)
  Top 0.152: 7.62,17.83 5.18,17.83 X1.A1 | 7.62,17.83 10.06,17.83 X1.C1 10.21,17.68 10.21,16.92 16.76,10.36 | 7.62,17.83 X1.B1 | 16.76,10.36 19.05,12.65 IC41.19 | 16.76,10.36 16.61,10.21 16.61,5.18 IC41.1 | IC41.10 39.32,5.18 39.32,10.82 38.1,12.04 IC27.7 38.1,17.83 37.19,18.75 37.19,26.36 38.1,27.28 IC44.8 38.1,29.26 37.19,30.18 37.19,37.8 38.1,38.71 IC43.7 | IC42.7 38.1,53.03 v37.19,52.12 | IC1.8 60.96,101.5 62.18,100.28 62.18,90.83 60.96,89.61 IC2.8 60.96,88.85 61.87,87.94 61.87,81.53 v60.66,80.31 | 7.62,96.62 5.18,96.62 X1.A32 | 7.62,96.62 10.06,96.62 X1.C32 10.21,96.62 14.63,96.62 22.4,104.39 35.36,104.39 v36.73,103.02 | 7.62,96.62 X1.B32 | IC18.7 38.1,94.64 37.19,95.56 37.19,100.58 38.1,101.5 IC17.7 | v60.66,77.88 60.96,77.57 IC3.8 60.96,74.83 61.87,74.83 63.09,73.61 63.09,66.6 60.96,64.47 IC4.8 60.96,62.18 62.33,62.18 63.4,61.11 64.31,61.11 v66.14,62.94 | IC5.10 89.31,100.74 89.31,95.56 90.07,94.79 90.07,89 IC6.10 | 90.22,63.86 90.22,67.97 91.14,68.89 91.14,75.29 90.22,76.2 IC7.10 | 90.22,63.86 90.22,62.33 IC8.10 | IC26.10 90.07,5.18 90.07,10.97 89.31,11.73 89.31,16.92 IC25.10 90.98,18.59 90.98,21.49 88.85,23.62 88.85,25.91 90.07,27.13 90.07,30.48 IC24.10 90.22,30.48 90.22,34.59 91.44,35.81 v91.44,36.27 | IC20.8 65.38,30.48 67.21,28.65 v76.5,28.65 | v88.24,63.86 90.22,63.86 | v89.31,54.86 89.31,44.04 IC23.10
  Bottom 0.152: 47.4,6.55 40.84,6.55 IC41.10 37.19,2.9 18.44,2.9 16.61,4.72 16.61,5.03 IC41.1 | 47.4,6.55 58.83,6.55 60.2,5.18 60.96,5.18 IC22.8 | IC21.8 60.96,17.83 57.76,21.03 41.3,21.03 38.1,17.83 IC27.7 | v37.19,52.12 37.19,44.2 38.1,43.28 IC43.7 | v36.73,103.02 38.1,101.65 IC17.7 | IC1.8 60.96,101.5 56.84,97.38 56.84,95.56 56.24,94.94 55.63,94.94 54.25,96.32 54.25,97.54 53.19,98.6 39.47,98.6 39.01,98.15 39.01,89.92 38.1,89 IC18.7 | v60.66,80.31 v60.66,77.88 | IC6.10 90.22,88.85 90.22,85.65 91.14,84.73 91.14,77.11 90.22,76.2 IC7.10 | IC20.8 60.96,36.27 61.87,37.19 61.87,42.22 60.96,43.13 IC19.8 | v91.44,36.27 91.44,38.71 90.22,39.93 90.22,43.13 IC23.10 | v76.5,28.65 88.24,28.65 90.07,30.48 IC24.10 | v89.31,54.86 89.31,57.61 88.54,58.37 88.54,63.25 88.24,63.55 v88.24,63.86 87.17,64.92 77.88,64.92 75.89,62.94 75.89,61.27 75.29,60.66 72.08,60.66 71.48,61.27 71.48,62.48 69.19,64.77 67.97,64.77 v66.14,62.94 | 47.4,6.55 47.4,4.12 49.23,2.29 72.24,2.29 73.91,0.61 85.65,0.61 90.07,5.03 IC26.10
N$1
  Top 0.152: IC1.13 51.66,108.36 51.66,95.56 50.9,94.79 50.9,89 IC2.4
N$2
  Top 0.152: IC2.5 53.34,94.64 52.27,95.71 52.27,108.05 53.34,109.12 IC1.12
N$3
  Top 0.152: IC2.13 49.68,95.4 49.68,79.7 50.75,78.64 50.75,74.98 IC3.4
N$4  (via drill 0.33)
  Top 0.152: v54.41,93.42 54.41,95.4 53.34,96.47 IC2.12
  Bottom 0.152: IC3.5 53.34,78.94 54.71,80.31 54.71,93.12 v54.41,93.42
N$5  (via drill 0.33)
  Top 0.152: v50.6,72.85 49.84,72.08 49.84,65.99 50.75,65.08 50.75,62.33 IC4.4 | v51.66,76.96 51.66,78.18 50.6,79.25 50.6,82.3 50.75,82.45 IC3.13
  Bottom 0.152: v50.6,72.85 51.66,73.91 v51.66,76.96
N$6  (via drill 0.33)
  Top 0.152: IC4.5 53.34,62.94 50.6,65.68 v50.6,68.12 | v48.46,72.85 47.4,73.91 47.4,78.64 v49.07,80.31
  Bottom 0.152: v50.6,68.12 49.53,69.19 49.53,71.78 v48.46,72.85 | v49.07,80.31 53.03,80.31 53.34,80.62 IC3.12
N$7
  Bottom 0.152: 55.93,98.91 55.93,99.82 56.84,100.74 56.84,108.2 55.93,109.12 IC1.11 | 55.93,98.91 55.93,96.62 IC2.11 | 55.93,98.91 31.24,98.91 28.65,101.5 28.04,101.5 IC17.3
N$8  (via drill 0.33)
  Top 0.152: v26.06,71.17 26.36,70.87 26.36,62.33 27.89,60.81 27.89,55.93 IC42.3
  Bottom 0.152: v26.06,71.17 24.23,73 24.23,95.1 24.54,95.4 24.54,98.91 26.67,101.04 26.67,102.72 29.26,105.31 37.64,105.31 42.82,100.13 51.97,100.13 53.34,101.5 IC1.5
N$9
  Top 0.152: IC42.6 35.51,55.93 35.51,61.72 34.59,62.64 34.59,69.8 45.87,81.08 48.62,81.08 49.38,81.84 49.38,100.13 50.75,101.5 IC1.4
N$26  (via drill 0.33)
  Top 0.152: v76.05,75.74 78.33,73.46 78.33,68.89 77.72,68.28 77.11,68.28 76.5,68.89 76.5,70.1 75.29,71.32 74.52,71.32 74.07,70.87 74.07,69.65 70.71,66.29 68.89,66.29 68.58,66.6 68.58,67.21 69.8,68.43 69.8,69.8 IC8.19 | IC6.19 69.8,96.47 69.8,90.68 68.89,89.76 68.89,84.73 69.8,83.82 IC7.19 | v39.78,97.99 v38.25,99.52
  Bottom 0.152: v76.05,75.74 76.05,77.72 69.95,83.82 IC7.19 | v38.25,99.52 36.27,101.5 35.66,101.5 IC17.6 | v39.78,97.99 51.21,97.99 52.43,96.77 52.43,95.56 53.34,94.64 67.97,94.64 IC6.19 73.3,99.97 73.3,102.56 69.95,105.92 69.95,109.12 IC5.19
N$27
  Top 0.152: IC6.1 67.21,89 67.21,94.34 66.14,95.4 66.14,100.43 IC5.1 67.21,101.65 67.21,105.31 61.11,111.4 33.38,111.4 31.24,109.27 30.48,109.27 IC17.11
N$28
  Top 0.152: 67.21,76.2 66.45,75.44 66.45,68.89 67.21,68.12 67.21,62.33 IC8.1 | 67.21,76.2 65.84,77.57 65.84,106.22 60.96,111.1 42.67,111.1 40.84,109.27 38.1,109.27 IC17.8 | 67.21,76.2 IC7.1
N$29  (via drill 0.33)
  Top 0.152: v54.1,83.97 54.41,83.97 55.78,82.6 IC3.11
  Bottom 0.152: v54.1,83.97 54.25,83.82 54.25,80.31 52.73,78.79 43.13,78.79 40.39,81.53 40.39,81.84 36.27,85.95 31.55,85.95 28.65,88.85 28.04,88.85 IC18.3 | IC4.11 55.78,69.95 55.78,71.63 54.71,72.69 54.71,79.86 55.78,80.92 55.78,82.45 IC3.11
N$58
  Top 0.152: IC20.4 50.9,30.48 50.9,36.27 51.66,37.03 51.66,49.99 50.9,50.75 IC19.13
N$59
  Top 0.152: IC20.5 53.34,33.53 52.12,34.75 52.12,49.53 53.34,50.75 IC19.12
N$60
  Top 0.152: IC21.4 50.75,17.83 50.75,23.62 49.84,24.54 49.84,37.19 50.75,38.1 IC20.13
N$61
  Top 0.152: IC21.5 53.34,23.47 54.25,24.38 54.25,32.77 53.65,33.38 53.65,33.68 52.73,34.59 52.73,37.49 IC20.12
N$62
  Top 0.152: IC21.13 51.66,24.54 51.66,11.73 50.9,10.97 50.9,5.18 IC22.4
N$63
  Top 0.152: IC22.5 53.34,10.82 52.43,11.73 52.43,24.38 53.34,25.3 IC21.12
N$64
  Bottom 0.152: IC27.3 28.04,17.83 28.04,23.62 29.26,24.84 29.26,26.52 30.48,27.74 30.94,27.74 32.16,28.96 32.16,30.18 36.42,34.44 53.95,34.44 55.78,36.27 55.78,38.1 IC20.11 55.93,38.1 57.15,39.32 57.15,45.11 55.93,46.33 55.93,50.75 IC19.11
N$65
  Bottom 0.152: IC43.3 28.04,43.13 28.65,43.13 30.18,41.6 37.34,41.6 42.67,36.27 45.72,36.27 47.4,37.95 47.4,39.17 48.16,39.93 53.34,39.93 54.1,40.69 54.1,42.37 53.34,43.13 IC19.5
N$66
  Top 0.152: IC43.6 35.66,43.28 36.27,43.28 37.64,44.65 49.38,44.65 50.75,43.28 IC19.4
N$83  (via drill 0.33)
  Top 0.152: v68.12,41.6 70.1,41.6 70.71,42.22 70.71,44.2 69.95,44.96 67.51,44.96 67.21,45.26 67.21,45.87 69.8,48.46 69.8,50.75 IC23.19
  Bottom 0.152: 67.67,27.58 48.92,27.58 48.31,26.98 37.8,26.98 37.19,26.36 37.19,24.08 35.66,22.55 35.66,17.83 IC27.6 | 67.67,27.58 IC25.19 69.95,25.3 69.95,23.77 71.02,22.71 71.02,16.61 69.95,15.54 69.95,12.8 IC26.19 | 69.8,38.1 69.8,35.05 68.58,33.83 68.58,28.5 67.67,27.58 | v68.12,41.6 68.12,39.78 69.8,38.1 | 69.8,38.1 IC24.19
N$84
  Bottom 0.152: IC27.11 30.48,25.45 31.24,25.45 33.07,27.28 48.16,27.28 48.77,27.89 64.62,27.89 67.21,30.48 IC24.1 67.36,30.48 68.28,31.39 68.28,39.01 67.36,39.93 67.36,43.13 IC23.1
N$85
  Bottom 0.152: 66.45,16.92 66.45,11.73 67.21,10.97 67.21,5.18 IC26.1 | IC25.1 66.45,16.92 | 66.45,16.92 62.03,21.34 43.59,21.34 39.62,25.3 38.1,25.3 IC27.8
N$86  (via drill 0.33)
  Top 0.152: IC22.11 54.56,14.02 54.56,23.77 55.78,24.99 55.78,25.3 IC21.11 | v41.6,65.23 v41.6,75.44 | v41.91,48.46 v41.91,57.91 | v42.52,40.54 47.7,40.54 49.23,39.01 v49.23,26.98
  Bottom 0.152: IC18.11 30.48,93.27 26.98,89.76 26.98,87.94 29.26,85.65 36.12,85.65 40.08,81.69 40.08,76.96 v41.6,75.44 | v41.6,65.23 41.6,58.22 v41.91,57.91 | v41.91,48.46 41.91,41.15 v42.52,40.54 | v49.23,26.98 54.25,26.98 55.78,25.45 IC21.11
N$116
  Top 0.152: IC41.17 24.08,12.8 23.77,12.8 12.19,24.38 8.53,24.38 7.62,25.3 X1.B4
N$118
  Top 0.152: IC41.15 29.11,12.8 28.5,12.8 25.91,15.39 22.1,15.39 10.67,26.82 8.69,26.82 7.62,27.89 X1.B5
N$119
  Top 0.152: X1.B6 8.69,29.41 10.21,29.41 11.28,28.35 11.28,26.98 22.55,15.7 30.63,15.7 33.53,12.8 34.29,12.8 IC41.13
N$120
  Bottom 0.152: IC41.11 33.22,6.55 23.77,6.55 22.55,5.33 22.55,4.12 21.64,3.2 18.59,3.2 17.37,4.42 17.37,9.14 9.14,17.37 9.14,31.7 9.3,31.85 9.3,32.46 8.84,32.92 7.62,32.92 X1.B7
N$121  (via drill 0.33)
  Top 0.152: IC41.8 34.29,8.23 v32.92,9.6 | v28.96,22.4 28.96,22.71 29.26,23.01 29.26,23.62 28.96,23.93 27.58,23.93 26.36,25.15 26.36,26.36 25.76,26.98 25.3,26.98 23.77,28.5 23.77,39.32 21.79,41.3 14.78,41.3 10.06,36.58 9.45,36.58 8.53,35.66 7.62,35.66 X1.B8
  Bottom 0.152: v32.92,9.6 30.18,12.34 30.18,15.7 28.96,16.92 v28.96,22.4
N$122  (via drill 0.33)
  Top 0.152: v3.96,31.7 3.96,15.7 16.46,3.2 26.67,3.2 28.5,5.03 29.11,5.03 IC41.6
  Bottom 0.152: v3.96,31.7 3.96,33.38 5.03,34.44 5.49,34.44 6.55,35.51 6.55,37.03 X1.B9
N$123  (via drill 0.33)
  Top 0.152: v11.73,23.47 19.96,15.24 19.96,4.88 21.34,3.5 21.95,3.5 23.47,5.03 24.08,5.03 IC41.4
  Bottom 0.152: v11.73,23.47 11.73,31.39 11.28,31.85 11.28,35.97 10.21,37.03 9.75,37.03 8.69,38.1 8.69,39.47 7.62,40.54 X1.B10
N$124
  Bottom 0.152: IC41.2 19.05,10.82 17.37,12.5 17.37,26.21 11.58,32 11.58,38.1 10.06,39.62 9.75,39.62 8.69,40.69 8.69,42.06 7.62,43.13 X1.B11
R0D0  (via drill 0.33)
  Top 0.152: v69.04,100.13 70.26,100.13 71.48,101.35 71.48,102.72 74.68,105.92 74.68,108.97 IC5.17 | v85.95,93.12 85.95,100.74 IC5.8
  Bottom 0.152: v69.04,100.13 66.9,100.13 63.86,103.17 60.66,103.17 59.13,101.65 58.52,101.65 IC1.7 | IC5.8 85.04,101.65 84.43,101.65 78.33,107.75 76.35,107.75 74.98,109.12 IC5.17 | JP1.1 95.25,90.22 93.27,92.2 86.87,92.2 v85.95,93.12
R0D1  (via drill 0.33)
  Top 0.152: v60.81,94.03 60.05,94.79 60.05,96.77 55.93,100.89 55.93,101.5 IC1.6 | IC5.6 IC5.15 | v93.88,96.01 v93.88,90.68
  Bottom 0.152: v60.81,94.03 69.19,94.03 71.48,96.32 71.48,97.54 74.07,100.13 78.64,100.13 80.01,101.5 IC5.6 | JP1.3 95.25,76.05 93.88,77.42 v93.88,90.68 | v93.88,96.01 88.54,101.35 88.54,102.56 83.36,107.75 81.38,107.75 80.01,109.12 IC5.15
R0D2  (via drill 0.33)
  Top 0.152: v36.73,112.01 74.98,112.01 76.35,113.39 77.27,113.39 | 77.27,113.39 80.92,113.39 IC5.13 85.19,109.27 86.72,110.8 87.94,110.8 88.54,110.19 88.54,108.97 92.05,105.46 92.05,88.54 v93.27,87.33 | 77.27,113.39 77.27,112.47 76.5,111.71 76.5,108.97 74.98,107.44 74.98,101.65 IC5.4
  Bottom 0.152: IC1.2 45.72,103.48 37.19,112.01 v36.73,112.01 | JP1.5 95.25,73.46 93.27,75.44 v93.27,87.33
R0D3  (via drill 0.33)
  Top 0.152: v75.59,111.71 73.3,109.42 73.3,105 69.95,101.65 IC5.2 | v92.66,91.59 92.66,106.68 90.22,109.12 IC5.11
  Bottom 0.152: IC5.2 67.97,103.48 61.87,103.48 57.15,108.2 57.15,109.88 56.24,110.8 55.63,110.8 55.02,110.19 55.02,107.44 53.34,105.77 53.03,105.77 48.92,101.65 48.31,101.65 IC1.3 | v75.59,111.71 87.02,111.71 89.46,109.27 90.07,109.27 IC5.11 | v92.66,91.59 92.66,71.17 93.88,69.95 95.25,69.95 JP1.7
R0D4  (via drill 0.33)
  Top 0.152: IC6.17 76.5,94.94 78.33,94.94 84.28,89 85.04,89 IC6.8 | v96.93,81.69 87.94,81.69 86.72,82.91 86.72,84.73 88.39,86.41 v88.7,86.41
  Bottom 0.152: IC2.7 62.64,93.12 71.48,93.12 74.83,96.47 IC6.17 | JP1.9 95.25,68.43 96.77,69.95 96.77,70.26 97.84,71.32 98.15,71.32 98.91,72.08 98.91,79.7 v96.93,81.69 | v88.7,86.41 88.24,86.41 85.8,88.85 85.19,88.85 IC6.8
R0D5
  Bottom 0.152: IC2.6 58.67,86.11 65.53,86.11 65.84,86.41 77.57,86.41 80.01,88.85 | IC6.15 IC6.6 80.01,88.85 | JP1.11 93.42,64.77 88.85,69.34 88.85,84.43 86.87,86.41 82.45,86.41 80.01,88.85
R0D6  (via drill 0.33)
  Top 0.152: v61.57,91.14 v60.66,92.05 | 76.5,86.72 76.81,87.02 85.04,87.02 85.95,87.94 85.95,89.92 85.19,90.68 85.19,96.47 IC6.13 | 76.5,86.72 75.89,86.72 74.98,87.63 74.98,88.85 IC6.4 | JP1.13 95.25,63.25 94.18,64.31 94.18,67.67 95.25,68.73 95.56,68.73 96.77,69.95 96.77,70.26 97.84,71.32 98.15,71.32 98.91,72.08 98.91,77.88 96.62,80.16 85.65,80.16 83.52,82.3 77.11,82.3 76.5,82.91 76.5,86.72
  Bottom 0.152: v60.66,92.05 58.67,94.03 51.51,94.03 46.48,89 45.72,89 IC2.2 | v61.57,91.14 72.69,91.14 IC6.4
R0D7  (via drill 0.33)
  Top 0.152: v59.13,86.87 v50.29,86.87 | v73.15,92.35 69.8,89 IC6.2 | JP1.15 95.25,60.81 96.47,62.03 96.47,67.51 v97.54,68.58 | v90.83,93.27 90.83,95.86 IC6.11
  Bottom 0.152: v50.29,86.87 IC2.3 | v59.13,86.87 59.89,86.87 60.05,86.72 64.31,86.72 64.92,87.33 68.28,87.33 IC6.2 | v73.15,92.35 75.89,95.1 75.89,96.77 78.18,99.06 87.02,99.06 89.46,96.62 90.07,96.62 IC6.11 | v97.54,68.58 97.99,68.58 99.21,69.8 99.21,86.72 92.66,93.27 v90.83,93.27
R0D8  (via drill 0.33)
  Top 0.152: v71.63,79.7 71.63,80.62 74.83,83.82 IC7.17 | v79.1,78.94 81.69,78.94 84.43,76.2 IC7.8 85.19,76.2 85.95,75.44 85.95,69.65 v87.48,68.12
  Bottom 0.152: v71.63,79.7 63.4,79.7 60.96,77.27 60.81,77.27 58.52,74.98 IC3.7 | v79.1,78.94 79.1,79.7 74.98,83.82 IC7.17 | JP1.17 95.25,57.76 91.14,61.87 91.14,64.47 v87.48,68.12
R0D9
  Bottom 0.152: IC7.6 77.42,73.61 71.63,73.61 70.71,72.69 58.67,72.69 56.54,74.83 55.93,74.83 IC3.6 | IC7.6 IC7.15 | IC7.6 80.62,76.2 85.95,70.87 85.95,68.28 88.85,65.38 88.85,60.81 94.94,54.71 95.25,54.71 JP1.19
R0D10  (via drill 0.33)
  Top 0.152: v58.06,72.39 v53.95,72.39 | v71.32,72.39 71.32,73.3 74.22,76.2 IC7.4 74.98,76.2 78.33,79.55 79.4,79.55 79.7,79.25 v84.12,79.25 | JP1.21 95.25,53.19 92.66,55.78 v92.66,57.91
  Bottom 0.152: v53.95,72.39 52.43,73.91 52.43,77.11 51.97,77.57 49.07,77.57 46.48,74.98 45.72,74.98 IC3.2 | v71.32,72.39 v58.06,72.39 | IC7.13 85.04,83.82 85.04,80.16 v84.12,79.25 86.26,77.11 86.26,68.43 89.15,65.53 89.15,61.42 v92.66,57.91
R0D11  (via drill 0.33)
  Top 0.152: v58.98,73.3 58.83,73.46 50.44,73.46 49.07,74.83 48.31,74.83 IC3.3 | v73.61,87.02 71.48,84.89 71.48,83.52 69.95,81.99 69.95,76.2 IC7.2
  Bottom 0.152: v58.98,73.3 58.98,73.61 60.05,74.68 60.05,75.89 61.87,77.72 68.28,77.72 69.8,76.2 IC7.2 | 90.07,83.82 90.07,78.03 89.31,77.27 89.31,72.54 91.59,70.26 91.59,69.49 95.25,65.84 95.71,65.84 96.32,65.23 96.32,64.31 95.25,63.25 94.79,63.25 94.03,62.48 94.03,59.44 95.25,58.22 95.71,58.22 96.32,57.61 96.32,50.6 JP1.23 | v73.61,87.02 75.59,87.02 75.89,86.72 77.11,86.72 79.1,88.7 79.1,97.54 79.55,97.99 82.91,97.99 84.12,96.77 84.12,87.94 85.04,87.02 87.17,87.02 90.07,84.12 90.07,83.82 | 90.07,83.82 IC7.11
R0D12  (via drill 0.33)
  Top 0.152: IC4.7 58.52,62.18 59.13,62.18 60.66,60.66 67.67,60.66 68.89,61.87 68.89,63.86 74.83,69.8 IC8.17 | v81.84,65.53 85.04,62.33 IC8.8
  Bottom 0.152: JP1.25 95.25,48.01 88.7,54.56 88.7,57.76 85.19,61.27 85.19,62.18 IC8.8 | v81.84,65.53 79.86,65.53 75.59,69.8 74.98,69.8 IC8.17
R0D13
  Top 0.152: 78.79,59.59 80.01,60.81 IC8.6 IC8.15 | 78.79,59.59 75.89,56.69 75.29,56.69 72.85,59.13 57.76,59.13 55.93,60.96 55.93,62.18 IC4.6 | JP1.27 95.25,45.11 91.14,49.23 91.14,53.95 88.39,56.69 81.69,56.69 78.79,59.59
R0D14  (via drill 0.33)
  Top 0.152: v60.81,65.23 v56.84,65.23 | JP1.29 93.73,41.91 93.57,42.06 92.35,42.06 v91.75,41.45 | v87.02,47.4 85.95,48.46 85.95,51.82 85.19,52.58 85.04,52.58 84.28,53.34 84.28,54.71 82.91,56.08 80.62,56.08 v80.31,55.78 | v76.05,60.05 76.05,61.11 IC8.4
  Bottom 0.152: v56.84,65.23 48.62,65.23 45.72,62.33 IC4.2 | v60.81,65.23 64.92,65.23 65.08,65.38 71.78,65.38 | IC8.4 71.78,65.38 | 71.78,65.38 73.3,66.9 73.3,70.1 74.52,71.32 82.91,71.32 84.28,69.95 85.04,69.95 IC8.13 | v91.75,41.45 91.75,43.43 87.78,47.4 v87.02,47.4 | v76.05,60.05 v80.31,55.78
R0D15  (via drill 0.33)
  Top 0.152: IC4.3 50.14,60.35 53.8,60.35 55.02,61.57 55.02,63.25 55.47,63.7 56.24,63.7 57.45,62.48 57.45,61.27 58.37,60.35 67.97,60.35 IC8.2 | v85.04,64.31 90.07,69.34 90.07,69.8 IC8.11 | v78.33,36.58 78.33,39.62 80.92,42.22 80.92,54.25 v79.4,55.78
  Bottom 0.152: v85.04,64.31 77.72,64.31 76.2,62.79 76.2,61.11 75.44,60.35 | 75.44,60.35 71.78,60.35 69.95,62.18 IC8.2 | JP1.31 95.25,38.71 91.9,35.36 88.54,35.36 85.95,37.95 85.95,39.17 85.5,39.62 84.73,39.62 83.52,38.41 83.52,37.19 82.91,36.58 v78.33,36.58 | v79.4,55.78 75.44,59.74 75.44,60.35
R1D0  (via drill 0.33)
  Top 0.152: 71.17,42.22 71.48,42.52 71.48,47.4 74.83,50.75 IC23.17 | 71.17,42.22 69.95,41 61.27,41 59.13,43.13 58.52,43.13 IC19.7 | 71.17,42.22 v71.78,41.6 | v83.06,57.3 86.41,60.66 90.53,60.66 91.44,61.57 91.44,70.1 94.79,73.46 95.25,73.46 96.32,74.52 96.32,74.98 97.69,76.35 97.69,77.42 JP1.2 | v83.06,55.02 83.06,52.12 83.82,51.36 83.82,48.16 85.04,46.94 85.04,43.28 IC23.8
  Bottom 0.152: v71.78,41.6 82.91,41.6 84.43,43.13 85.04,43.13 IC23.8 | v83.06,55.02 v83.06,57.3
R1D1  (via drill 0.33)
  Top 0.152: IC19.6 55.93,43.13 56.54,43.13 58.98,40.69 77.57,40.69 80.01,43.13 IC23.6 IC23.15 | v93.88,70.87 93.88,70.41 92.51,69.04 92.51,61.72 88.7,57.91 v87.63,57.91
  Bottom 0.152: v93.88,70.87 95.25,70.87 96.32,71.93 96.32,72.39 97.69,73.76 97.69,74.83 JP1.4 | v87.63,57.91 87.63,52.73 85.95,51.05 85.95,49.84 85.34,49.23 83.36,49.23 79.55,45.41 79.1,45.41 78.79,45.11 78.79,44.5 80.01,43.28 IC23.6
R1D2  (via drill 0.33)
  Top 0.152: JP1.6 96.77,72.39 95.25,70.87 94.79,70.87 92.81,68.89 92.81,61.57 88.54,57.3 v87.02,57.3
  Bottom 0.152: IC19.2 45.72,48.92 44.81,49.84 44.81,51.82 45.26,52.27 48.62,52.27 49.84,51.05 49.84,49.84 51.05,48.62 53.03,48.62 54.25,49.84 54.25,51.51 55.32,52.58 56.39,52.58 57.45,51.51 57.45,49.84 59.59,47.7 65.08,47.7 | 65.08,47.7 70.41,47.7 IC23.4 | 65.08,47.7 65.08,49.23 65.38,49.53 65.99,49.53 66.29,49.23 82.91,49.23 84.43,50.75 85.04,50.75 IC23.13 87.02,52.73 v87.02,57.3
R1D3  (via drill 0.33)
  Top 0.152: v56.54,44.81 67.21,44.81 67.36,44.65 68.43,44.65 69.8,43.28 IC23.2 | v91.75,50.6 91.75,58.06 v94.64,60.96 | v73.61,43.59 74.07,44.04 74.07,44.2 74.68,44.81 v79.4,44.81
  Bottom 0.152: v56.54,44.81 50.6,44.81 49.07,43.28 48.31,43.28 IC19.3 | v91.75,50.6 91.59,50.75 90.22,50.75 IC23.11 90.07,50.75 88.54,49.23 86.56,49.23 86.26,48.92 84.12,48.92 80.01,44.81 v79.4,44.81 | v94.64,60.96 95.4,60.96 96.77,62.33 96.77,68.89 97.69,69.8 JP1.8 | v73.61,43.59 73.61,43.89 72.85,44.65 71.93,44.65 70.56,43.28 69.95,43.28 IC23.2
R1D4  (via drill 0.33)
  Top 0.152: v67.67,35.2 71.93,35.2 74.83,38.1 IC24.17 | JP1.10 97.69,67.21 97.69,66.14 96.77,65.23 96.77,55.47 96.32,55.02 96.32,51.66 95.25,50.6 94.79,50.6 94.18,49.99 94.18,46.63 95.25,45.57 95.56,45.57 96.32,44.81 96.32,44.04 95.56,43.28 92.2,43.28 88.85,39.93 85.04,39.93 84.12,39.01 84.12,32.61 85.04,31.7 85.04,30.48 IC24.8
  Bottom 0.152: IC20.7 59.13,30.48 60.66,28.96 61.42,28.96 v67.67,35.2 | IC24.8 85.04,30.48 85.04,31.7 81.08,35.66 77.42,35.66 74.98,38.1 IC24.17
R1D5  (via drill 0.33)
  Top 0.152: IC20.6 56.54,30.48 58.98,28.04 77.57,28.04 78.18,28.65 | 78.18,28.65 IC24.6 IC24.15 | 78.18,28.65 v78.79,28.04
  Bottom 0.152: v78.79,28.04 89.61,28.04 100.13,38.56 100.13,61.42 97.84,63.7 97.84,64.77 JP1.12
R1D6  (via drill 0.33)
  Top 0.152: v55.93,33.68 71.63,33.68 74.83,30.48 IC24.4 | v92.05,33.98 v93.27,32.77